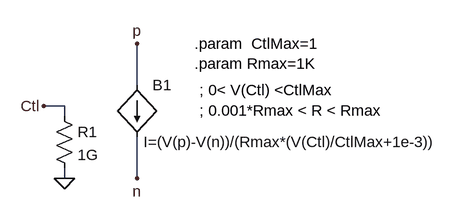
[diagram p0: schematic Rctl.asc]
Rctl.asc, the LTspice schematic file:
Version 4
SHEET 1 880 680
WIRE 192 144 192 80
WIRE 80 176 48 176
WIRE 80 192 80 176
WIRE 80 288 80 272
WIRE 192 288 192 224
FLAG 80 288 0
FLAG 48 176 Ctl
FLAG 192 80 p
FLAG 192 288 n
SYMBOL bi 192 144 R0
WINDOW 3 10 88 Left 2
SYMATTR Value I=(V(p)-V(n))/(Rmax*(V(Ctl)/CtlMax+1e-3))
SYMATTR InstName B1
SYMBOL res 64 176 R0
SYMATTR InstName R1
SYMATTR Value 1G
TEXT 280 80 Left 2 !.param  CtlMax=1\n.param Rmax=1K
TEXT 288 152 Left 2 !; 0< V(Ctl) <CtlMax \n; 0.001*Rmax < R < Rmax

The netlist it stands for:
* Rctl.asc
B1 p n I=(V(p)-V(n))/(Rmax*(V(Ctl)/CtlMax+1e-3))
R1 Ctl 0 1G
.param  CtlMax=1
.param Rmax=1K
; 0< V(Ctl) <CtlMax
; 0.001*Rmax < R < Rmax
.backanno
.end